# Altium schematic sheet STM32.SchDoc
size A3; SheetNumber: 1; SheetTotal: 2
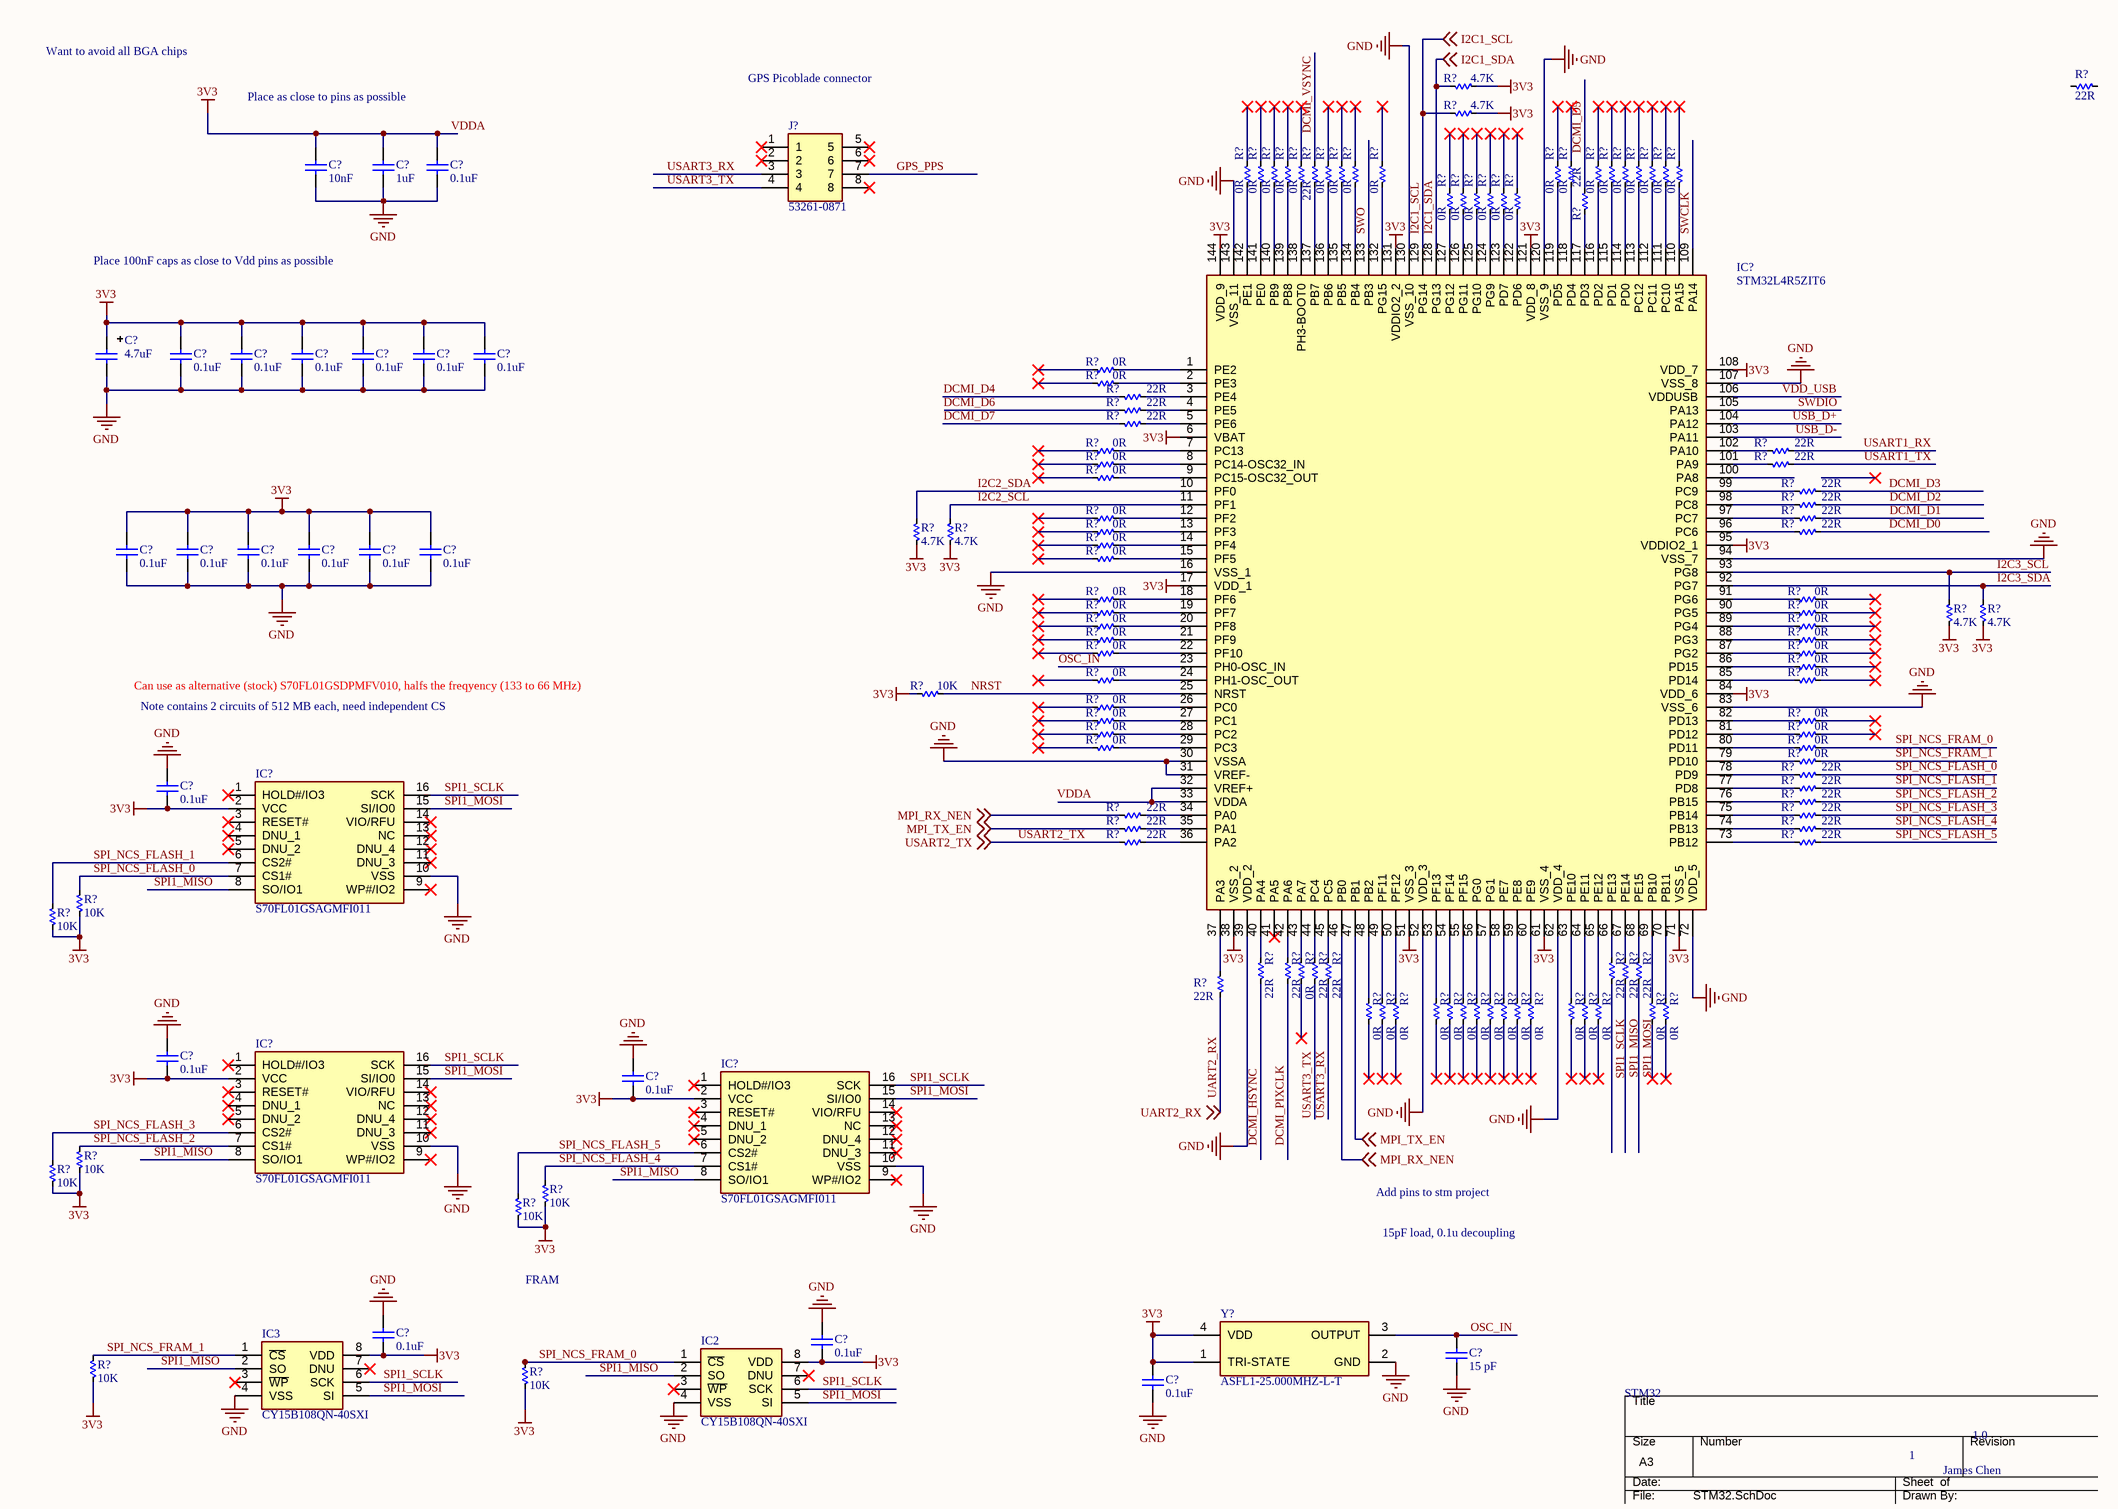
[diagram p0: STM32.SchDoc]

## Parts
(Parts that share a designator on the sheet are numbered #1, #2 ... from top to bottom, then left to right.)
C?#1  10nF  [0603]
C?#2  1uF  [0603]
C?#3  0.1uF  [0402]
C?#4  4.7uF  [CAP TANT 1206 (A) TCJ]
C?#5  0.1uF  [0402]
C?#6  0.1uF  [0402]
C?#7  0.1uF  [0402]
C?#8  0.1uF  [0402]
C?#9  0.1uF  [0402]
C?#10  0.1uF  [0402]
C?#11  0.1uF  [0402]
C?#12  0.1uF  [0402]
C?#13  0.1uF  [0402]
C?#14  0.1uF  [0402]
C?#15  0.1uF  [0402]
C?#16  0.1uF  [0402]
C?#17  0.1uF  [0402]
C?#18  0.1uF  [0402]
C?#19  0.1uF  [0402]
C?#20  0.1uF  [0402]
C?#21  0.1uF  [0402]
C?#22  0.1uF  [0402]
C?#23  15 pF  [0603]
IC2  CY15B108QN-40SXI  [SOIC127P800X203-8N]
IC3  CY15B108QN-40SXI  [SOIC127P800X203-8N]
IC?#1  STM32L4R5ZIT6  [QFP50P2200X2200X160-144N]
IC?#2  S70FL01GSAGMFI011  [SOIC127P1030X265-16N]
IC?#3  S70FL01GSAGMFI011  [SOIC127P1030X265-16N]
IC?#4  S70FL01GSAGMFI011  [SOIC127P1030X265-16N]
J?  53261-0871  [53261-0871]
R?#1  4.7k  [0402]
R?#2  22R  [0402]
R?#3  4.7k  [0402]
R?#4  0R  [0402]
R?#5  0R  [0402]
R?#6  0R  [0402]
R?#7  0R  [0402]
R?#8  0R  [0402]
R?#9  0R  [0402]
R?#10  0R  [0402]
R?#11  0R  [0402]
R?#12  0R  [0402]
R?#13  0R  [0402]
R?#14  0R  [0402]
R?#15  0R  [0402]
R?#16  0R  [0402]
R?#17  0R  [0402]
R?#18  0R  [0402]
R?#19  0R  [0402]
R?#20  0R  [0402]
R?#21  0R  [0402]
R?#22  22R  [0402]
R?#23  0R  [0402]
R?#24  0R  [0402]
R?#25  0R  [0402]
R?#26  0R  [0402]
R?#27  0R  [0402]
R?#28  0R  [0402]
R?#29  22R  [0402]
R?#30  0R  [0402]
R?#31  0R  [0402]
R?#32  22R  [0402]
R?#33  22R  [0402]
R?#34  22R  [0402]
R?#35  0R  [0402]
R?#36  22R  [0402]
R?#37  0R  [0402]
R?#38  22R  [0402]
R?#39  0R  [0402]
R?#40  22R  [0402]
R?#41  22R  [0402]
R?#42  4.7k  [0402]
R?#43  0R  [0402]
R?#44  22R  [0402]
R?#45  0R  [0402]
R?#46  22R  [0402]
R?#47  4.7k  [0402]
R?#48  0R  [0402]
R?#49  0R  [0402]
R?#50  0R  [0402]
R?#51  0R  [0402]
R?#52  4.7k  [0402]
R?#53  0R  [0402]
R?#54  0R  [0402]
R?#55  0R  [0402]
R?#56  0R  [0402]
R?#57  4.7k  [0402]
R?#58  0R  [0402]
R?#59  0R  [0402]
R?#60  0R  [0402]
R?#61  0R  [0402]
R?#62  0R  [0402]
R?#63  0R  [0402]
R?#64  0R  [0402]
R?#65  10K  [0402]
R?#66  0R  [0402]
R?#67  0R  [0402]
R?#68  0R  [0402]
R?#69  0R  [0402]
R?#70  0R  [0402]
R?#71  0R  [0402]
R?#72  0R  [0402]
R?#73  0R  [0402]
R?#74  22R  [0402]
R?#75  22R  [0402]
R?#76  22R  [0402]
R?#77  22R  [0402]
R?#78  22R  [0402]
R?#79  22R  [0402]
R?#80  22R  [0402]
R?#81  22R  [0402]
R?#82  22R  [0402]
R?#83  10K  [0402]
R?#84  10K  [0402]
R?#85  22R  [0402]
R?#86  22R  [0402]
R?#87  0R  [0402]
R?#88  22R  [0402]
R?#89  22R  [0402]
R?#90  22R  [0402]
R?#91  22R  [0402]
R?#92  22R  [0402]
R?#93  22R  [0402]
R?#94  0R  [0402]
R?#95  0R  [0402]
R?#96  0R  [0402]
R?#97  0R  [0402]
R?#98  0R  [0402]
R?#99  0R  [0402]
R?#100  0R  [0402]
R?#101  0R  [0402]
R?#102  0R  [0402]
R?#103  0R  [0402]
R?#104  0R  [0402]
R?#105  0R  [0402]
R?#106  0R  [0402]
R?#107  0R  [0402]
R?#108  0R  [0402]
R?#109  0R  [0402]
R?#110  10K  [0402]
R?#111  10K  [0402]
R?#112  10K  [0402]
R?#113  10K  [0402]
R?#114  10K  [0402]
R?#115  10K  [0402]
Y?  ASFL1-25.000MHZ-L-T  [ASFL125000MHZLT]

## Nets
GND: C?#1.1 C?#2.1 C?#3.1 C?#4.2 C?#5.1 C?#6.1 C?#7.1 C?#8.1 C?#9.1 C?#10.1 C?#11.1 C?#12.1 C?#13.1 C?#14.1 C?#15.1 C?#16.1 C?#17.2 C?#18.2 C?#19.2 C?#20.2 C?#21.2 C?#22.2 C?#23.1 IC2.4(VSS) IC3.4(VSS) IC?#1.16(VSS_1) IC?#1.30(VSSA) IC?#1.31(VREF-) IC?#1.39(VDD_2) IC?#1.52(VDD_3) IC?#1.62(VDD_4) IC?#1.72(VDD_5) IC?#1.83(VSS_6) IC?#1.94(VSS_7) IC?#1.107(VSS_8) IC?#1.120(VSS_9) IC?#1.130(VSS_10) IC?#1.143(VSS_11) IC?#2.10(VSS) IC?#3.10(VSS) IC?#4.10(VSS) Y?.2(GND)
VDDA: C?#1.2 C?#2.2 C?#3.2 C?#4.1 C?#5.2 C?#6.2 C?#7.2 C?#8.2 C?#9.2 C?#10.2 C?#11.2 C?#12.2 C?#13.2 C?#14.2 C?#15.2 C?#16.2 C?#17.1 C?#18.1 C?#19.1 C?#20.1 C?#21.1 C?#22.1 IC2.8(VDD) IC3.8(VDD) IC?#1.6(VBAT) IC?#1.17(VDD_1) IC?#1.38(VSS_2) IC?#1.51(VSS_3) IC?#1.61(VSS_4) IC?#1.71(VSS_5) IC?#1.84(VDD_6) IC?#1.95(VDDIO2_1) IC?#1.108(VDD_7) IC?#1.121(VDD_8) IC?#1.131(VDDIO2_2) IC?#1.144(VDD_9) IC?#2.2(VCC) IC?#3.2(VCC) IC?#4.2(VCC) R?#1.1 R?#3.2 R?#42.2 R?#47.1 R?#52.2 R?#57.1 R?#65.1 R?#83.1 R?#84.1 R?#110.1 R?#111.1 R?#112.1 R?#113.1 R?#114.1 R?#115.1 Y?.1(TRI-STATE) Y?.4(VDD)  [also labelled 3V3]
DCMI_D0: R?#46.2
DCMI_D1: R?#44.2
DCMI_D2: R?#41.2
DCMI_D3: R?#40.2
DCMI_D4: R?#32.1
DCMI_D5: R?#29.2
DCMI_D7: R?#34.1
DCMI_HSYNC: R?#85.1
DCMI_PIXCLK: R?#86.1
DCMI_VSYNC: R?#22.2
GPS_PPS: J?.7
I2C1_SCL: IC?#1.129(PG14) R?#3.1 ; off-sheet I2C1_SCL
I2C1_SDA: IC?#1.128(PG13) R?#1.2 ; off-sheet I2C1_SDA
I2C2_SCL: IC?#1.11(PF1) R?#47.2
I2C2_SDA: IC?#1.10(PF0) R?#42.1
I2C3_SCL: IC?#1.93(PG8) R?#52.1
I2C3_SDA: IC?#1.92(PG7) R?#57.2
MPI_RX_NEN: IC?#1.46(PB0) R?#77.1 ; off-sheet MPI_RX_NEN
MPI_TX_EN: IC?#1.47(PB1) R?#79.1 ; off-sheet MPI_TX_EN
NRST: IC?#1.25(NRST) R?#65.2
OSC_IN: C?#23.2 IC?#1.23(PH0-OSC_IN) Y?.3(OUTPUT)
SPI1_MISO: IC2.2(SO) IC3.2(SO) IC?#2.8(SO/IO1) IC?#3.8(SO/IO1) IC?#4.8(SO/IO1) R?#91.1
SPI1_MOSI: IC2.5(SI) IC3.5(SI) IC?#2.15(SI/IO0) IC?#3.15(SI/IO0) IC?#4.15(SI/IO0) R?#92.1
SPI1_SCLK: IC2.6(SCK) IC3.6(SCK) IC?#2.16(SCK) IC?#3.16(SCK) IC?#4.16(SCK) R?#90.1
SPI_NCS_FLASH_0: IC?#2.7(CS1#) R?#74.2 R?#83.2
SPI_NCS_FLASH_1: IC?#2.6(CS2#) R?#75.2 R?#84.2
SPI_NCS_FLASH_2: IC?#3.7(CS1#) R?#76.2 R?#110.2
SPI_NCS_FLASH_3: IC?#3.6(CS2#) R?#78.2 R?#111.2
SPI_NCS_FLASH_4: IC?#4.7(CS1#) R?#80.2 R?#112.2
SPI_NCS_FLASH_5: IC?#4.6(CS2#) R?#82.2 R?#113.2
SPI_NCS_FRAM_0: IC2.1(~{CS}) R?#72.2 R?#115.2
SPI_NCS_FRAM_1: IC3.1(~{CS}) R?#73.2 R?#114.2
SWCLK: IC?#1.109(PA14)
SWDIO: IC?#1.105(PA13)
SWO: IC?#1.133(PB3)
UART2_RX: R?#93.1 ; off-sheet UART2_RX
USART1_RX: R?#36.2
USART1_TX: R?#38.2
USART2_TX: R?#81.1 ; off-sheet USART2_TX
USART3_RX: J?.3 R?#89.1
USART3_TX: J?.4 R?#88.1
USB_D+: IC?#1.104(PA12)
USB_D-: IC?#1.103(PA11)
VDD_USB: IC?#1.106(VDDUSB)
NetIC?#1_1: IC?#1.1(PE2) R?#30.2
NetIC?#1_2: IC?#1.2(PE3) R?#31.2
NetIC?#1_3: IC?#1.3(PE4) R?#32.2
NetIC?#1_4: IC?#1.4(PE5) R?#33.2
NetIC?#1_5: IC?#1.5(PE6) R?#34.2
NetIC?#1_7: IC?#1.7(PC13) R?#35.2
NetIC?#1_8: IC?#1.8(PC14-OSC32_IN) R?#37.2
NetIC?#1_9: IC?#1.9(PC15-OSC32_OUT) R?#39.2
NetIC?#1_12: IC?#1.12(PF2) R?#43.2
NetIC?#1_13: IC?#1.13(PF3) R?#45.2
NetIC?#1_14: IC?#1.14(PF4) R?#48.2
NetIC?#1_15: IC?#1.15(PF5) R?#49.2
NetIC?#1_18: IC?#1.18(PF6) R?#50.2
NetIC?#1_19: IC?#1.19(PF7) R?#53.2
NetIC?#1_20: IC?#1.20(PF8) R?#55.2
NetIC?#1_21: IC?#1.21(PF9) R?#58.2
NetIC?#1_22: IC?#1.22(PF10) R?#60.2
NetIC?#1_24: IC?#1.24(PH1-OSC_OUT) R?#63.2
NetIC?#1_26: IC?#1.26(PC0) R?#66.2
NetIC?#1_27: IC?#1.27(PC1) R?#67.2
NetIC?#1_28: IC?#1.28(PC2) R?#69.2
NetIC?#1_29: IC?#1.29(PC3) R?#71.2
NetIC?#1_32: IC?#1.32(VREF+) IC?#1.33(VDDA)
NetIC?#1_34: IC?#1.34(PA0) R?#77.2
NetIC?#1_35: IC?#1.35(PA1) R?#79.2
NetIC?#1_36: IC?#1.36(PA2) R?#81.2
NetIC?#1_37: IC?#1.37(PA3) R?#93.2
NetIC?#1_40: IC?#1.40(PA4) R?#85.2
NetIC?#1_42: IC?#1.42(PA6) R?#86.2
NetIC?#1_43: IC?#1.43(PA7) R?#87.2
NetIC?#1_44: IC?#1.44(PC4) R?#88.2
NetIC?#1_45: IC?#1.45(PC5) R?#89.2
NetIC?#1_48: IC?#1.48(PB2) R?#94.2
NetIC?#1_49: IC?#1.49(PF11) R?#95.2
NetIC?#1_50: IC?#1.50(PF12) R?#96.2
NetIC?#1_53: IC?#1.53(PF13) R?#97.2
NetIC?#1_54: IC?#1.54(PF14) R?#98.2
NetIC?#1_55: IC?#1.55(PF15) R?#99.2
NetIC?#1_56: IC?#1.56(PG0) R?#100.2
NetIC?#1_57: IC?#1.57(PG1) R?#101.2
NetIC?#1_58: IC?#1.58(PE7) R?#102.2
NetIC?#1_59: IC?#1.59(PE8) R?#103.2
NetIC?#1_60: IC?#1.60(PE9) R?#104.2
NetIC?#1_63: IC?#1.63(PE10) R?#105.2
NetIC?#1_64: IC?#1.64(PE11) R?#106.2
NetIC?#1_65: IC?#1.65(PE12) R?#107.2
NetIC?#1_66: IC?#1.66(PE13) R?#90.2
NetIC?#1_67: IC?#1.67(PE14) R?#91.2
NetIC?#1_68: IC?#1.68(PE15) R?#92.2
NetIC?#1_69: IC?#1.69(PB10) R?#108.2
NetIC?#1_70: IC?#1.70(PB11) R?#109.2
NetIC?#1_73: IC?#1.73(PB12) R?#82.1
NetIC?#1_74: IC?#1.74(PB13) R?#80.1
NetIC?#1_75: IC?#1.75(PB14) R?#78.1
NetIC?#1_76: IC?#1.76(PB15) R?#76.1
NetIC?#1_77: IC?#1.77(PD8) R?#75.1
NetIC?#1_78: IC?#1.78(PD9) R?#74.1
NetIC?#1_79: IC?#1.79(PD10) R?#73.1
NetIC?#1_80: IC?#1.80(PD11) R?#72.1
NetIC?#1_81: IC?#1.81(PD12) R?#70.1
NetIC?#1_82: IC?#1.82(PD13) R?#68.1
NetIC?#1_85: IC?#1.85(PD14) R?#64.1
NetIC?#1_86: IC?#1.86(PD15) R?#62.1
NetIC?#1_87: IC?#1.87(PG2) R?#61.1
NetIC?#1_88: IC?#1.88(PG3) R?#59.1
NetIC?#1_89: IC?#1.89(PG4) R?#56.1
NetIC?#1_90: IC?#1.90(PG5) R?#54.1
NetIC?#1_91: IC?#1.91(PG6) R?#51.1
NetIC?#1_96: IC?#1.96(PC6) R?#46.1
NetIC?#1_97: IC?#1.97(PC7) R?#44.1
NetIC?#1_98: IC?#1.98(PC8) R?#41.1
NetIC?#1_99: IC?#1.99(PC9) R?#40.1
NetIC?#1_101: IC?#1.101(PA9) R?#38.1
NetIC?#1_102: IC?#1.102(PA10) R?#36.1
NetIC?#1_110: IC?#1.110(PA15) R?#21.2
NetIC?#1_111: IC?#1.111(PC10) R?#20.2
NetIC?#1_112: IC?#1.112(PC11) R?#19.2
NetIC?#1_113: IC?#1.113(PC12) R?#18.2
NetIC?#1_114: IC?#1.114(PD0) R?#17.2
NetIC?#1_115: IC?#1.115(PD1) R?#16.2
NetIC?#1_116: IC?#1.116(PD2) R?#15.2
NetIC?#1_117: IC?#1.117(PD3) R?#29.1
NetIC?#1_118: IC?#1.118(PD4) R?#14.2
NetIC?#1_119: IC?#1.119(PD5) R?#13.2
NetIC?#1_122: IC?#1.122(PD6) R?#28.2
NetIC?#1_123: IC?#1.123(PD7) R?#27.2
NetIC?#1_124: IC?#1.124(PG9) R?#26.2
NetIC?#1_125: IC?#1.125(PG10) R?#25.2
NetIC?#1_126: IC?#1.126(PG11) R?#24.2
NetIC?#1_127: IC?#1.127(PG12) R?#23.2
NetIC?#1_132: IC?#1.132(PG15) R?#12.2
NetIC?#1_134: IC?#1.134(PB4) R?#11.2
NetIC?#1_135: IC?#1.135(PB5) R?#10.2
NetIC?#1_136: IC?#1.136(PB6) R?#9.2
NetIC?#1_137: IC?#1.137(PB7) R?#22.1
NetIC?#1_138: IC?#1.138(PH3-BOOT0) R?#8.2
NetIC?#1_139: IC?#1.139(PB8) R?#7.2
NetIC?#1_140: IC?#1.140(PB9) R?#6.2
NetIC?#1_141: IC?#1.141(PE0) R?#5.2
NetIC?#1_142: IC?#1.142(PE1) R?#4.2

Not connected (* = marked no-connect by the designer): IC2 3(~{WP})* 7(DNU)*; IC3 3(~{WP})* 7(DNU)*; IC?#1 41(PA5)* 100(PA8); IC?#2 1(HOLD#/IO3)* 3(RESET#)* 4(DNU_1)* 5(DNU_2)* 9(WP#/IO2)* 11(DNU_3)* 12(DNU_4)* 13(NC)* 14(VIO/RFU)*; IC?#3 1(HOLD#/IO3)* 3(RESET#)* 4(DNU_1)* 5(DNU_2)* 9(WP#/IO2)* 11(DNU_3)* 12(DNU_4)* 13(NC)* 14(VIO/RFU)*; IC?#4 1(HOLD#/IO3)* 3(RESET#)* 4(DNU_1)* 5(DNU_2)* 9(WP#/IO2)* 11(DNU_3)* 12(DNU_4)* 13(NC)* 14(VIO/RFU)*; J? 1* 2* 5* 6* 8*; R?#2 1 2; R?#4 1*; R?#5 1*; R?#6 1*; R?#7 1*; R?#8 1*; R?#9 1*; R?#10 1*; R?#11 1*; R?#12 1*; R?#13 1*; R?#14 1*; R?#15 1*; R?#16 1*; R?#17 1*; R?#18 1*; R?#19 1*; R?#20 1*; R?#21 1*; R?#23 1*; R?#24 1*; R?#25 1*; R?#26 1*; R?#27 1*; R?#28 1*; R?#30 1*; R?#31 1*; R?#33 1; R?#35 1*; R?#37 1*; R?#39 1*; R?#43 1*; R?#45 1*; R?#48 1*; R?#49 1*; R?#50 1*; R?#51 2*; R?#53 1*; R?#54 2*; R?#55 1*; R?#56 2*; R?#58 1*; R?#59 2*; R?#60 1*; R?#61 2*; R?#62 2*; R?#63 1*; R?#64 2*; R?#66 1*; R?#67 1*; R?#68 2*; R?#69 1*; R?#70 2*; R?#71 1*; R?#87 1*; R?#94 1*; R?#95 1*; R?#96 1*; R?#97 1*; R?#98 1*; R?#99 1*; R?#100 1*; R?#101 1*; R?#102 1*; R?#103 1*; R?#104 1*; R?#105 1*; R?#106 1*; R?#107 1*; R?#108 1*; R?#109 1*

## Notes on the sheet
- Want to avoid all BGA chips
- Place as close to pins as possible
- GPS Picoblade connector
- Place 100nF caps as close to Vdd pins as possible
- Can use as alternative (stock) S70FL01GSDPMFV010, halfs the freqyency (133 to 66 MHz)
- Note contains 2 circuits of 512 MB each, need independent CS
- Add pins to stm project
- 15pF load, 0.1u decoupling
- FRAM
- STM32
- 1
- 1.0
- James Chen
- Labels drawn without touching a wire or pin: DCMI_D6, VDDA
- THIS DOCUMENT AND THE DATA DISCLOSED HEREIN OR
- HEREWITH IS THE PROPERTY OF ALTIUM LIMITED AND MAY
- DWG NO:
- REVISION
- REV:
- DESCRIPTION
- DATE
- APPROVED
- BE FREELY DISTRIBUTED IN WHOLE. NO RIGHTS ARE
- RESERVED OR EXPRESS OR IMPLIED WARANTEE GIVEN.
- ENG:
- APPROVALS
- PROJECT
- DSN:
- CHK:
- REFERENCE DOCUMENTS
- PROJECT REVISION:
- TITLE
- DOCUMENT REVISION:
- DESIGN ITEM:
- BOM:
- FAB DWG:
- PCB DWG:
- ASSY DWG:
- SCALE:
- A3
- SIZE
- CAGE CODE
- FILE NAME
- DWG NO.
- SHEET
- OF
- REV

## Library data of the parts
C?#1 = CC-103-K-50V-X7R-0603: CAP CER 10000PF 50V X7R 0603; Manufacturer: KEMET; Manufacturer Part #: C0603C103K5RAC3190; Checked By: *; Created By: *; Distributor: Digikey; Distributor Part #: 399-C0603C103K5RAC3190CT-ND; History: *; Notes: *; Part Description: CAP CER 10000PF 50V X7R 0603; Population: *; ROHS: Yes; SignalCraft Part #: *; Alternate Distributor Part #: *; Alternate Manufacturer: *; Alternate Manufacturer Part #: *; Value: 10nF
C?#2 = CC-105-K-25V-X7R-0603: CAP CER 1UF 25V X7R 0603; Manufacturer: Yageo; Manufacturer Part #: CC0603KRX7R8BB105; Checked By: *; ComponentLink1Description: Datasheet; ComponentLink1URL: https://www.yageo.com/upload/media/product/productsearch/datasheet/mlcc/UPY-GPHC_X7R_6.3V-to-50V_18.pdf; ComponentLink2Description: Manufacture Website; ComponentLink2URL: https://www.yageo.com/en/Home; Created By: *; Distributor: Digikey; Distributor Part #: 311-1802-1-ND; History: *; Notes: *; Part Description: CAP CER 1UF 25V X7R 0603; Population: *; ROHS: Yes; SignalCraft Part #: CC-105-K-25V-X7R-0603; Alternate Distributor Part #: *; Alternate Manufacturer: *; Alternate Manufacturer Part #: *; Value: 1uF
C?#3 C?#5-C?#22 = CC-104-K-25V-X5R-0402: CAP CER 0.1UF 25V X5R 0402; Manufacturer: Taiyo Yuden; Manufacturer Part #: TMK105BJ104KV-F; Checked By: *; ComponentLink1description: Datasheet; ComponentLink1URL: https://ds.yuden.co.jp/TYCOMPAS/ut/detail?pn=TMK105BJ104KV-F%20%20&u=M; ComponentLink2description: Manufacturer Website; Created By: *; Distributor: Digikey; Distributor Part #: 587-1456-1-ND; History: *; Notes: *; Part Description: CAP CER 0.1UF 25V X5R 0402; Population: *; ROHS: Yes; SignalCraft Part #: CC-104-K-25V-X5R-0402; ComponentLink2URL: https://www.yuden.co.jp/or/; Value: 0.1uF
C?#4 = CT-474-M-20V-OTH-1206: 4.7 µF Molded Tantalum Capacitors 20 V 1206 (3216 Metric) 4Ohm; Manufacturer: AVX Corporation; Manufacturer Part #: TAJA475K020RNJ; Alternate Distributor Part #: *; Alternate Manufacturer: *; Alternate Manufacturer Part #: *; Checked By: *; ComponentLink1Description: Datasheet; ComponentLink1URL: *; ComponentLink2Description: Manufacturer Website; ComponentLink2URL: *; Created By: *; Distributor: Digikey; Distributor Part #: 478-1668-1-ND; History: *; Notes: *; Part Description: 4.7 µF Molded Tantalum Capacitors 20 V 1206 (3216 Metric) 4Ohm; Population: *; ROHS: *; SignalCraft Part #: *; Value: 4.7uF
C?#23 = CC-159-J-50V-C0G-0402: 15 pF ±1% 50V Ceramic Capacitor C0G, NP0 0402 (1005 Metric); Manufacturer: YAGEO; Manufacturer Part #: CC0402FRNPO9BN150; Checked By: *; ComponentLink1Description: Datasheet; ComponentLink1URL: *; ComponentLink2Description: Manufacture Website; ComponentLink2URL: *; Created By: *; Distributor: Digikey; Distributor Part #: 311-1642-1-ND; History: *; Notes: *; Part Description: 15 pF ±1% 50V Ceramic Capacitor C0G, NP0 0402 (1005 Metric); Population: *; ROHS: *; SignalCraft Part #: *; Alternate Distributor Part #: *; Alternate Manufacturer: *; Alternate Manufacturer Part #: *; Value: 15 pF
IC2 IC3 = CY15B108QN-40SXI: Integrated Circuit; Manufacturer_Name: Cypress Semiconductor; Datasheet Link: https://www.cypress.com/file/444186/download; Height: 2.03mm; Manufacturer_Part_Number: CY15B108QN-40SXI; Mouser Part Number: 727-CY15B108QN-40SXI; Mouser Price/Stock: https://www.mouser.co.uk/ProductDetail/Cypress-Semiconductor/CY15B108QN-40SXI?qs=P1JMDcb91o4DSS%2FkAQM5uA%3D%3D; Arrow Part Number: CY15B108QN-40SXI; Arrow Price/Stock: https://www.arrow.com/en/products/cy15b108qn-40sxi/cypress-semiconductor
IC?#1 = STM32L4R5ZIT6: Integrated Circuit; Manufacturer_Name: ST; Datasheet Link: https://www.st.com/resource/en/datasheet/stm32l4r5zi.pdf; Height: 1.6mm; Manufacturer_Part_Number: STM32L4R5ZIT6
IC?#2-IC?#4 = S70FL01GSAGMFI011: Integrated Circuit; Manufacturer_Name: Cypress Semiconductor; Datasheet Link: http://www.cypress.com/file/233721/download; Height: 2.65mm; Manufacturer_Part_Number: S70FL01GSAGMFI011; Mouser Part Number: 797-70FL01GSAGMFI011; Mouser Price/Stock: https://www.mouser.co.uk/ProductDetail/Cypress-Spansion/S70FL01GSAGMFI011?qs=7dLKRY2uEGfd5QhmKnP1mQ%3D%3D; Arrow Part Number: S70FL01GSAGMFI011; Arrow Price/Stock: https://www.arrow.com/en/products/s70fl01gsagmfi011/cypress-semiconductor
J? = 53261-0871: Connector; Manufacturer_Name: Molex; Datasheet Link: https://componentsearchengine.com//53261-0871.pdf; Mouser2 Part Number: 538-53261-0871; Mouser2 Price/Stock: https://www.mouser.com/Search/Refine.aspx?Keyword=538-53261-0871; Manufacturer_Part_Number: 53261-0871
R?#1 R?#3 R?#42 R?#47 R?#52 R?#57 = RT-4K70-F-1/16W-0402: RES SMD 4.7K OHM 1% 1/16W 0402; Manufacturer: Yageo; Manufacturer Part #: RC0402FR-074K7L; Checked By: *; ComponentLink1Description: Datasheet; ComponentLink1URL: https://www.yageo.com/upload/media/product/productsearch/datasheet/rchip/PYu-RC_Group_51_RoHS_L_11.pdf; ComponentLink2Description: Manufacture Website; ComponentLink2URL: https://www.yageo.com/en/Home; Created By: *; Distributor: Digikey; Distributor Part #: 311-4.7KLRCT-ND; History: *; Notes: *; Part Description: RES SMD 4.7K OHM 1% 1/16W 0402; Population: *; ROHS: Yes; SignalCraft Part #: RT-4K70-F-1/16W-0402; Alternate Distributor Part #: *; Alternate Manufacturer: *; Alternate Manufacturer Part #: *; Value: 4.7K
R?#2 R?#22 R?#29 R?#32-R?#34 R?#36 R?#38 R?#40 R?#41 R?#44 R?#46 R?#74-R?#82 R?#85 R?#86 R?#88-R?#93 = RT-22R0-F-1/16W-0402: RES SMD 22 OHM 1% 1/16W 0402; Alternate Manufacturer: Yageo; Alternate Manufacturer Part #: RC0402FR-0722RL; Manufacturer: Vishay Dale; Manufacturer Part #: CRCW040222R0FKED; Checked By: *; ComponentLink1description: Datasheet; ComponentLink1URL: https://www.vishay.com/docs/20035/dcrcwe3.pdf; ComponentLink2description: Manufacturer Website; Alternate Distributor Part #: 311-22.0LRCT-ND; Created By: *; Distributor: Digikey; Distributor Part #: 541-22.0LCT-ND; History: *; Notes: *; Part Description: RES SMD 22 OHM 1% 1/16W 0402; Population: *; ROHS: Yes; SignalCraft Part #: RT-22R0-F-1/16W-0402; ComponentLink2URL: https://www.vishay.com/; Value: 22R
R?#4-R?#21 R?#23-R?#28 R?#30 R?#31 R?#35 R?#37 R?#39 R?#43 R?#45 R?#48-R?#51 R?#53-R?#56 R?#58-R?#64 R?#66-R?#73 R?#87 R?#94-R?#109 = RT-0R00-F-1/10W-0402: RES SMD 0 OHM JUMPER 1/10W 0402; Alternate Manufacturer: Yageo; Alternate Manufacturer Part #: RC0402JR-070RL; Manufacturer: Panasonic Electronic Components; Manufacturer Part #: ERJ-2GE0R00X; RS2D ID: R0R00F10010402; Checked By: *; ComponentLink1description: Datasheet; ComponentLink1URL: https://industrial.panasonic.com/ww/products/resistors/chip-resistors/general-purpose-chip-resistors/models/ERJ2GE0R00X; ComponentLink2description: Manufacturer Website; Alternate Distributor Part #: 311-0.0JRCT-ND; Created By: *; Distributor: Digikey; Distributor Part #: P0.0JCT-ND; History: *; Notes: *; Part Description: RES SMD 0 OHM JUMPER 1/10W 0402; Population: *; ROHS: Yes; SignalCraft Part #: RT-0R00-F-1/10W-0402; ComponentLink2URL: https://industrial.panasonic.com/ww/products/resistors/chip-resistors/general-purpose-chip-resistors/models/ERJ2GE0R00X; Value: 0R
R?#65 R?#83 R?#84 R?#110-R?#115 = RT-10K0-F-1/16W-0402: RES SMD 10K OHM 1% 1/16W 0402; Alternate Manufacturer: Yageo; Alternate Manufacturer Part #: RC0402FR-0710KL; Manufacturer: Vishay Dale; Manufacturer Part #: CRCW040210K0FKED; Checked By: *; ComponentLink1description: Datasheet; ComponentLink1URL: https://www.vishay.com/docs/20035/dcrcwe3.pdf; ComponentLink2description: Manufacturer Website; Alternate Distributor Part #: 311-10.0KLRCT-ND; Created By: *; Distributor: Digikey; Distributor Part #: 541-10.0KLCT-ND; History: *; Notes: *; Part Description: RES SMD 10K OHM 1% 1/16W 0402; Population: *; ROHS: Yes; SignalCraft Part #: RT-10K0-F-1/16W-0402; ComponentLink2URL: https://www.vishay.com/; Value: 10K
Y? = ASFL1-25.000MHZ-L-T: Crystal or Oscillator; Manufacturer_Name: ABRACON; Datasheet Link: https://componentsearchengine.com/Datasheets/1/ASFL1-25.000MHZ-L-T.pdf; Height: 1.3mm; Manufacturer_Part_Number: ASFL1-25.000MHZ-L-T; Mouser Part Number: 815-ASFL1-25-L-T; Mouser Price/Stock: https://www.mouser.co.uk/ProductDetail/ABRACON/ASFL1-25000MHZ-L-T?qs=jv7ULIbIBgOiRkeuuil%252BKg%3D%3D; Arrow Part Number: ASFL1-25.000MHZ-L-T; Arrow Price/Stock: https://www.arrow.com/en/products/asfl1-25.000mhz-l-t/abracon?region=nac